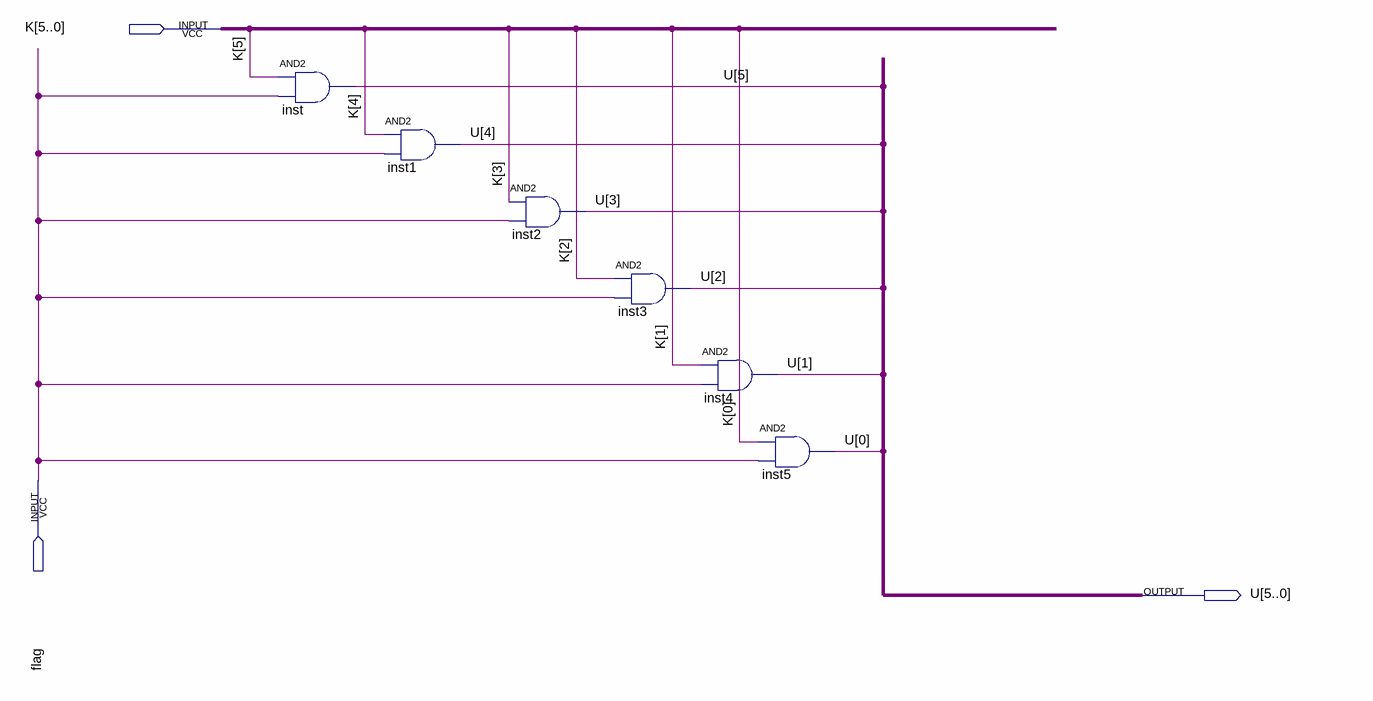
[diagram p0: schematic sheet]
// Quartus schematic TESTE.bdf as structural Verilog: 6 symbols, 3 pins
module TESTE (
  input  [5:0] K,
  input  flag,
  output [5:0] U
);

  and inst (U[5], K[5], flag);
  and inst1 (U[4], K[4], flag);
  and inst2 (U[3], K[3], flag);
  and inst3 (U[2], K[2], flag);
  and inst4 (U[1], K[1], flag);
  and inst5 (U[0], K[0], flag);
endmodule
